# Altium project Placa Infrarrojos.PrjPcb
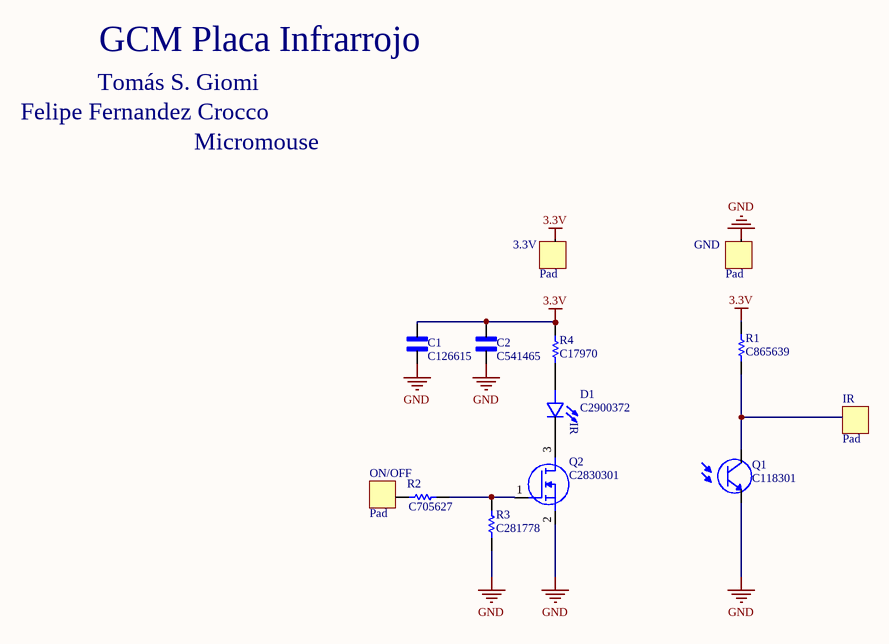
[diagram p0: Sheet1.SchDoc]
1 sheet, 13 parts. Net scope: global (net labels, ports and power ports of the same name join across sheets).
Board file: PCB1.PcbDoc

## Sheet Sheet1.SchDoc
size A; SheetNumber: 1; SheetTotal: 1

### Parts
3.3V  Pad  [PCBComponent_1]
C1  C126615  [CAP_CC1210_YAG]
C2  C541465  [CAPC1005X55N]
D1  C2900372  [DIO_SFH_4545]
GND  Pad  [PCBComponent_1]
IR  Pad  [PCBComponent_1]
ON/OFF  Pad  [PCBComponent_1]
Q1  C118301  [XDCR_TEFT4300]
Q2  C2830301  [SOT50P160X90-3N]
R1  C865639  [RESC2012X60N]
R2  C705627  [RESC1005X35N]
R3  C281778  [RESC1005X35N]
R4  C17970  [RESC3115X65N]

### Nets
3.3V: 3.3V.1 C1.2 C2.2 R1.2 R4.2
GND: C1.1 C2.1 GND.1 Q1.E Q2.2(S) R3.1
NetD1_A: D1.A R4.1
NetD1_C: D1.C Q2.3(D)
NetIR_1: IR.1 Q1.C R1.1
NetON/OFF_1: ON/OFF.1 R2.1
NetQ2_1: Q2.1(G) R2.2 R3.2

### Notes on the sheet
- GCM Placa Infrarrojo
- Felipe Fernandez Crocco
- Tomás S. Giomi
- Micromouse
- (in symbol SFH_4545) IR

### Library data of the parts
C1 = CC1210KKX7R7BB226: Description; Manufacturer_Name: Yageo; Copyright: Copyright (C) 2026 Ultra Librarian. All rights reserved.; Manufacturer_Part_Number: CC1210KKX7R7BB226
C2 = CC0402JRX7R8BB103: 10000 pF Â±5% 25V Ceramic Capacitor X7R 0402 (1005 Metric); MF: Yageo; SnapEDA_Link: https://www.snapeda.com/parts/CC0402JRX7R8BB103/Yageo/view-part/?ref=snap; Package: 0402 Yageo; Value: *; MP: CC0402JRX7R8BB103; Check_prices: https://www.snapeda.com/parts/CC0402JRX7R8BB103/Yageo/view-part/?ref=eda
D1 = SFH_4545: Infrared (IR) Emitter 950nm 1.5V 100mA 550mW/sr @ 100mA 10Â° Radial; MF: OSRAM Opto; SnapEDA_Link: https://www.snapeda.com/parts/SFH%204545/OSRAM/view-part/?ref=snap; Package: None; Value: *; MP: SFH 4545; Check_prices: https://www.snapeda.com/parts/SFH%204545/OSRAM/view-part/?ref=eda
Q1 = TEFT4300: Phototransistors 925nm Top View Radial, 3mm Dia (T-1); MF: Vishay Semiconductor; SnapEDA_Link: https://www.snapeda.com/parts/TEFT4300/Vishay/view-part/?ref=snap; Package: None; Value: *; MP: TEFT4300; Check_prices: https://www.snapeda.com/parts/TEFT4300/Vishay/view-part/?ref=eda
Q2 = DMG1012T-7: MOSFET N-Channel 20V 0.63A SOT523 | Diodes Inc DMG1012T-7; MF: Diodes Inc.; SnapEDA_Link: https://www.snapeda.com/parts/DMG1012T-7/Diodes+Inc./view-part/?ref=snap; Package: SOT-523 Diodes Inc.; Value: *; MP: DMG1012T-7; Check_prices: https://www.snapeda.com/parts/DMG1012T-7/Diodes+Inc./view-part/?ref=eda
R1 = RT0805BRD07510RL: 5.6 Ohm 1/4W Thick Film Resistor 1206 Chip - Surface Mount; MF: Uni-Royal; MP: 1206W4F560KT5E; SnapEDA_Link: https://www.snapeda.com/parts/1206W4F560KT5E/Uni-Royal/view-part/?ref=snap; Package: 1206-2 ROYAL; Value: *; Check_prices: https://www.snapeda.com/parts/1206W4F560KT5E/Uni-Royal/view-part/?ref=eda
R2 R3 = RT0402FRE0724KL: RT Series 0402 0.063 W 24 kOhm Â±1 % Â±50 ppm/Â°C SMT Thin Film Chip Resistor; MF: Yageo; SnapEDA_Link: https://www.snapeda.com/parts/RT0402FRE0724KL/Yageo/view-part/?ref=snap; Package: 1005 Yageo; Value: *; MP: RT0402FRE0724KL; Check_prices: https://www.snapeda.com/parts/RT0402FRE0724KL/Yageo/view-part/?ref=eda
R4 = 1206W4F560KT5E: 5.6 Ohm 1/4W Thick Film Resistor 1206 Chip - Surface Mount; MF: Uni-Royal; SnapEDA_Link: https://www.snapeda.com/parts/1206W4F560KT5E/Uni-Royal/view-part/?ref=snap; Package: 1206-2 ROYAL; Value: *; MP: 1206W4F560KT5E; Check_prices: https://www.snapeda.com/parts/1206W4F560KT5E/Uni-Royal/view-part/?ref=eda